# EAGLE design Robot Motor Connector v1.2 (EAGLE 4.16)
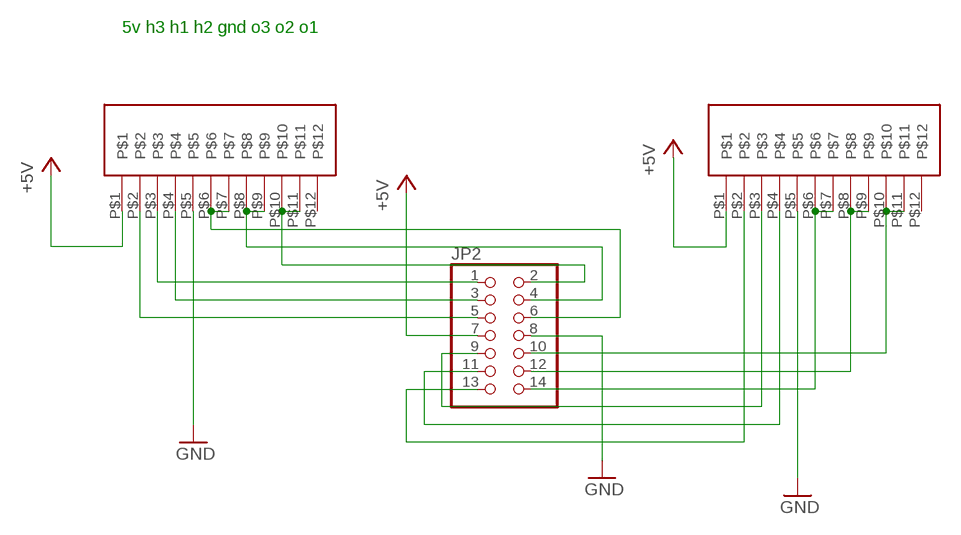
[diagram p0: schematic, sheet 1]

## Parts
JP2  PINHD-2X7  [2X07]
U$5  MOLEX52207-1290  [MOLEX12PINSMT]
U$8  MOLEX52207-1290  [MOLEX12PINSMT]

## Nets
+5V [supply]: JP2.7 U$5.P$1 U$8.P$1
GND [supply]: JP2.8 U$5.P$5 U$8.P$5
N$15: JP2.9 U$8.P$3
N$16: JP2.11 U$8.P$4
N$17: JP2.13 U$8.P$2
N$33: JP2.1 U$5.P$3
N$46: JP2.3 U$5.P$4
N$48: JP2.5 U$5.P$2
N$56 [motor]: JP2.14 U$8.P$6 U$8.P$7
N$65 [motor]: JP2.12 U$8.P$8 U$8.P$9
N$66 [motor]: JP2.10 U$8.P$10 U$8.P$11
N$67 [motor]: JP2.2 U$5.P$10 U$5.P$11
N$71 [motor]: JP2.4 U$5.P$8 U$5.P$9
N$72 [motor]: JP2.6 U$5.P$6 U$5.P$7
Unconnected: U$5.P$12 U$8.P$12

## Notes on the sheet
- 5v h3 h1 h2 gnd o3 o2 o1

## Library data of the parts
JP2 = pinhead:PINHD-2X7: PIN HEADER
U$5 U$8 = molex:MOLEX52207-1290

## Net classes
1 supply: width 0.508 mm
2 motor: width 0.508 mm

## Board
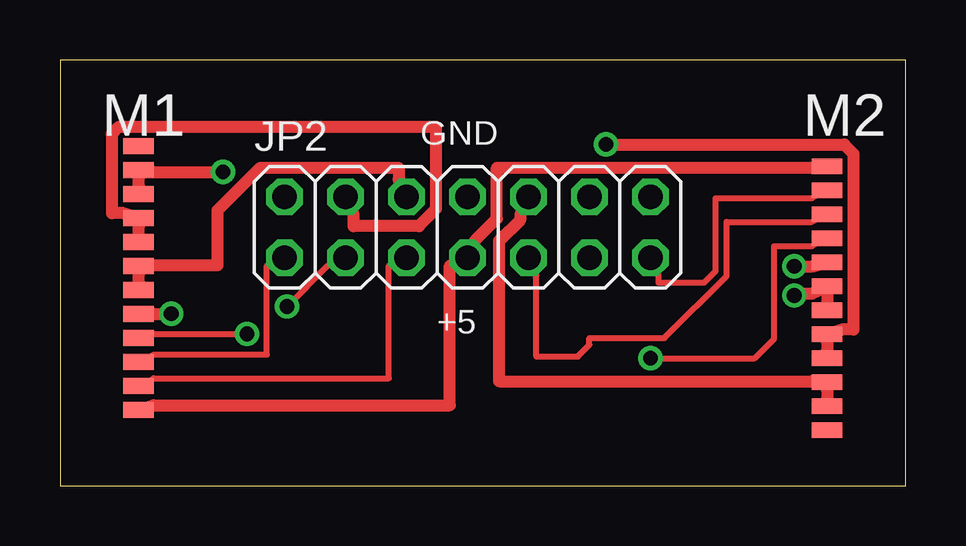
[diagram p1: board, top side]
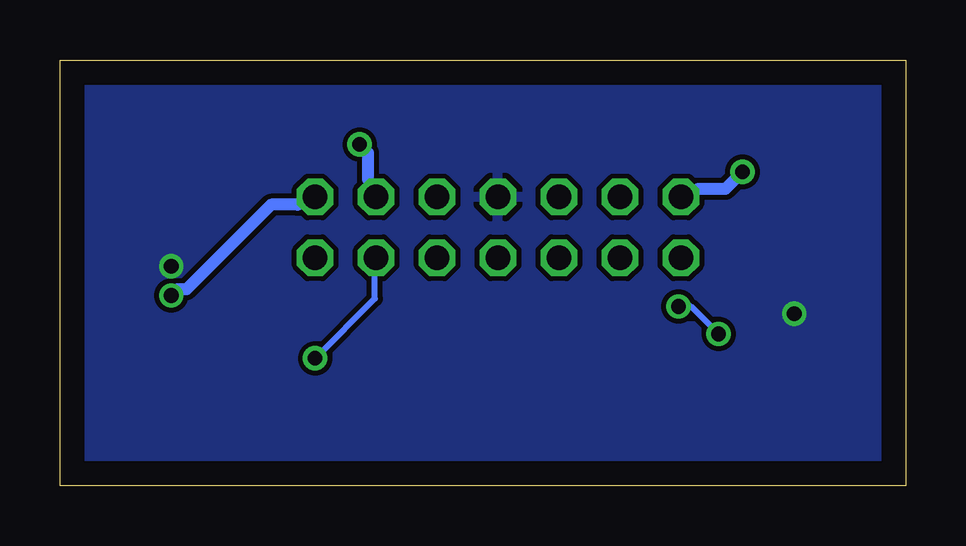
[diagram p2: board, bottom side, seen from below]

Size 35.23 x 17.77 mm. Coordinates in mm from the lower left corner, seen from the top.
Outline: 0,0 35.23,0 35.23,17.77 0,17.77 0,0
Copper layers (1*16): Top 0.035mm / dielectric 1.5mm / Bottom 0.035mm
Design rules "default": minimum track width 10mil, minimum drill 24mil, track to track 8mil, track to pad 8mil, pad to pad 8mil, via to via 8mil, smd to smd 8mil, copper to edge 40mil, drill to drill 8mil, minimum pad ring 10mil, minimum via ring 8mil, stop-mask expansion 4mil, vias tented up to drill 0mil, thermal gap 10mil

### Footprints (pad centres in the part's own frame; a part is rotated, then mirrored left to right if it is on the bottom)
2X07 = drill 1.016 octagon: 1 -7.62,-1.27; 2 -7.62,1.27; 3 -5.08,-1.27; 4 -5.08,1.27; 5 -2.54,-1.27; 6 -2.54,1.27; 7 0,-1.27; 8 0,1.27; 9 2.54,-1.27; 10 2.54,1.27; 11 5.08,-1.27; 12 5.08,1.27; 13 7.62,-1.27; 14 7.62,1.27
MOLEX12PINSMT = smd 0.66 x 1.27: P$1 0,1; P$2 1,1; P$3 2,1; P$4 3,1; P$5 4,1; P$6 5,1; P$7 6,1; P$8 7,1; P$9 8,1; P$10 9,1; P$11 10,1; P$12 11,1

### Placement (x,y rotation side)
JP2  16.98,10.79 0 top
U$5  4.28,3.17 90 top
U$8  30.95,13.33 270 top

### Tracks (layer width: path | path; a pad name or v marks a point on that pad's centre or on a via)
+5V
  Top 0.508: U$5.P$1 3.9,3.37 16.24,3.37 16.24,9.19 JP2.7 17.31,10.26 18.2,11.15 18.2,13.28 31.33,13.28 U$8.P$1
GND  (via drill 0.61)
  Top 0.508: v4.64,7.18 3.9,7.18 U$5.P$5 | v30.59,9.16 31.33,9.16 U$8.P$5
  pour Bottom: 0.47,0.63 0.47,17.14 34.76,17.14 34.76,0.63
N$15
  Top 0.254: U$8.P$3 31.33,11.02 27.77,11.02 27.77,8.76 25.18,6.17 22.06,6.17 22.06,5.89 21.58,5.41 19.85,5.41 19.85,8.78 JP2.9
N$16  (via drill 0.61)
  Top 0.254: v24.6,5.33 28.94,5.33 29.76,6.14 29.76,10 31.33,10 U$8.P$4
  Bottom 0.254: v24.6,5.33 22.11,7.82 22.11,8.78 JP2.11
N$17
  Top 0.254: U$8.P$2 31.33,12.01 27.32,12.01 27.32,8.96 26.83,8.48 24.93,8.48 24.93,8.78 JP2.13
N$33
  Top 0.254: U$5.P$3 3.9,5.48 8.62,5.48 8.62,9.19 JP2.1
N$46  (via drill 0.61)
  Top 0.254: v7.79,6.34 3.9,6.34 U$5.P$4 | v9.46,7.49 11.16,9.19 JP2.3
  Bottom 0.254: v7.79,6.34 8.93,7.49 v9.46,7.49
N$48
  Top 0.254: U$5.P$2 3.9,4.49 13.7,4.49 13.7,9.19 JP2.5
N$56  (via drill 0.61)
  Top 0.508: U$8.P$7 31.97,7.64 31.97,8.02 U$8.P$6 31.33,8.02 30.59,8.02 v30.59,7.95
  Bottom 0.508: v30.59,7.95 30.34,8.2 29.96,8.2 26.43,11.73 25.34,11.73 JP2.14
N$65  (via drill 0.61)
  Top 0.508: U$8.P$9 31.97,5.66 31.97,6.01 U$8.P$8 32.58,6.52 33.06,6.52 33.06,13.86 32.68,14.24 v22.75,14.24
  Bottom 0.508: v22.75,14.24 22.39,13.89 22.39,12.8 JP2.12
N$66
  Top 0.508: U$8.P$11 31.97,3.65 31.97,4.01 U$8.P$10 31.33,4.36 18.3,4.36 18.3,10.23 19.19,11.12 19.19,11.32 JP2.10
N$67  (via drill 0.61)
  Top 0.508: U$5.P$10 3.29,12.49 3.29,12.85 U$5.P$11 3.9,13.1 v6.79,13.1
  Bottom 0.508: v6.79,13.1 7.51,12.39 8.62,12.39 JP2.2
N$71
  Top 0.508: U$5.P$8 3.29,10.49 3.29,10.84 U$5.P$9 2.65,11.37 2.17,11.37 2.17,14.7 2.45,14.98 15.66,14.98 15.66,11.55 14.95,10.84 12.23,10.84 12.23,11.32 JP2.4
N$72
  Top 0.508: U$5.P$6 3.29,8.48 3.29,8.86 U$5.P$7 3.9,9.22 6.57,9.22 6.57,11.5 8.34,13.28 14.11,13.28 14.11,12.8 JP2.6

### Text on the board
tPlace: GND | M1 | M2 | +5